# Altium schematic sheet Pyro_Channel.SchDoc
size B; SheetNumber: 5; SheetTotal: 7
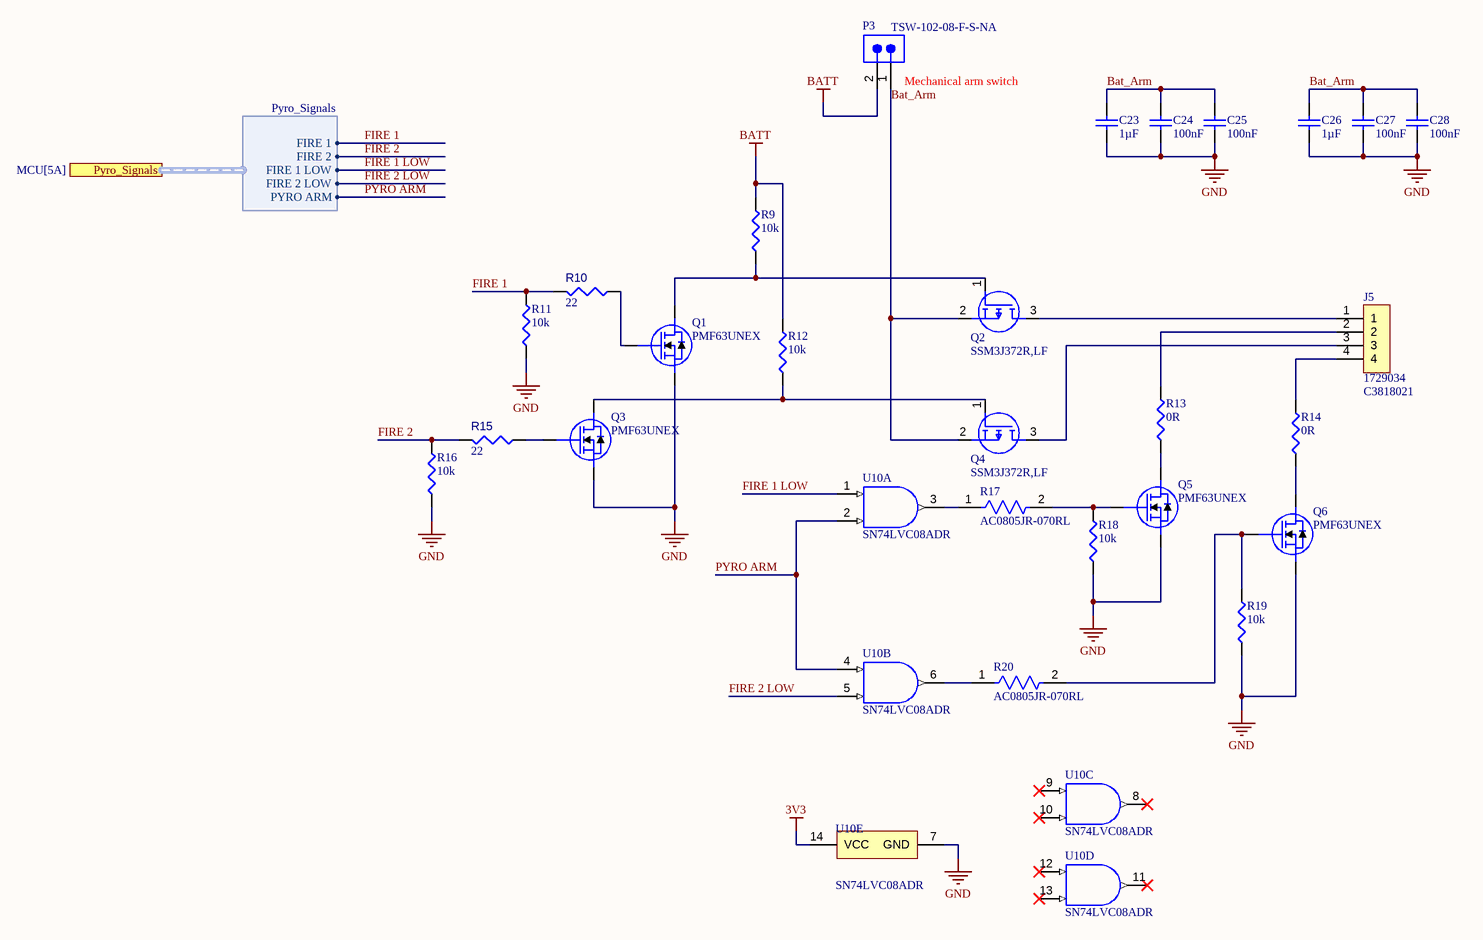
[diagram p0: Pyro_Channel.SchDoc]

## Parts
C23  value 1µF  [0402_C]  (hidden comment: CL05A105KL5NRNC)
C24  100nF  [0402_C]
C25  100nF  [0402_C]
C26  value 1µF  [0402_C]  (hidden comment: CL05A105KL5NRNC)
C27  100nF  [0402_C]
C28  100nF  [0402_C]
J5  1729034  LCSC Part Number: C3818021  [1729034]
P3  TSW-102-08-F-S-NA  [SMTC-TSW-102-08-X-S-NA]
Q1  PMF63UNEX  [PMF63UNEX-Footprint-1]
Q2  SSM3J372R,LF  [SSM3J372RLF]
Q3  PMF63UNEX  [PMF63UNEX-Footprint-1]
Q4  SSM3J372R,LF  [SSM3J372RLF]
Q5  PMF63UNEX  [PMF63UNEX-Footprint-1]
Q6  PMF63UNEX  [PMF63UNEX-Footprint-1]
R9  10k  [0402_R]
R10  value 22  [RESC0402(1005)_L]  (hidden comment: Resistor 22R  +/-5 % 0402 63 mW)
R11  10k  [0402_R]
R12  10k  [0402_R]
R13  0R  [0402_R]
R14  0R  [0402_R]
R15  value 22  [RESC0402(1005)_L]  (hidden comment: Resistor 22R  +/-5 % 0402 63 mW)
R16  10k  [0402_R]
R17  AC0805JR-070RL  [FP-AC0805-0_6-MFG]
R18  10k  [0402_R]
R19  10k  [0402_R]
R20  AC0805JR-070RL  [FP-AC0805-0_6-MFG]
U10  SN74LVC08ADR  [D0014A_N]  (parts A,B,C,D,E of 5)

## Ports
Pyro_Signals (harness Pyro_Signals, see MCU[5A])

## Harnesses
Pyro_Signals: FIRE 1, FIRE 2, FIRE 1 LOW, PYRO ARM, FIRE 2 LOW

## Nets
3V3: U10.14(VCC)
BATT: P3.2 R9.1 R12.1
GND: C23.1 C24.1 C25.1 C26.1 C27.1 C28.1 Q1.3(S) Q3.3(S) Q5.3(S) Q6.3(S) R11.1 R16.1 R18.1 R19.1 U10.7(GND)
Bat_Arm: C23.2 C24.2 C25.2 C26.2 C27.2 C28.2 P3.1 Q2.2(S) Q4.2(S)
FIRE 1: R10.2 R11.2 ; port Pyro_Signals.FIRE 1
FIRE 1 LOW: U10.1(1A) ; port Pyro_Signals.FIRE 1 LOW
FIRE 2: R15.2 R16.2 ; port Pyro_Signals.FIRE 2
FIRE 2 LOW: U10.5(2B) ; port Pyro_Signals.FIRE 2 LOW
PYRO ARM: U10.2(1B) U10.4(2A) ; port Pyro_Signals.PYRO ARM
NetJ5_1: J5.1 Q2.3(D)
NetJ5_2: J5.2 R13.2
NetJ5_3: J5.3 Q4.3(D)
NetJ5_4: J5.4 R14.2
NetQ1_1: Q1.1(G) R10.1
NetQ1_2: Q1.2(D) Q2.1(G) R9.2
NetQ3_1: Q3.1(G) R15.1
NetQ3_2: Q3.2(D) Q4.1(G) R12.2
NetQ5_1: Q5.1(G) R17.2 R18.2
NetQ5_2: Q5.2(D) R13.1
NetQ6_1: Q6.1(G) R19.2 R20.2
NetQ6_2: Q6.2(D) R14.1
NetR17_1: R17.1 U10.3(1Y)
NetR20_1: R20.1 U10.6(2Y)

Not connected (* = marked no-connect by the designer): U10 8(3Y)* 9(3A)* 10(3B)* 11(4Y)* 12(4A)* 13(4B)*

## Notes on the sheet
- (near P3) Mechanical arm switch
- DWG NO:
- REV:
- THIS DOCUMENT AND THE DATA DISCLOSED HEREIN OR
- HEREWITH IS THE PROPERTY OF ALTIUM LIMITED AND MAY
- BE FREELY DISTRIBUTED IN WHOLE. NO RIGHTS ARE
- RESERVED OR EXPRESS OR IMPLIED WARANTEE GIVEN.
- REVISION
- DESCRIPTION
- DATE
- APPROVED
- ENG:
- APPROVALS
- PROJECT
- DSN:
- CHK:
- REFERENCE DOCUMENTS
- PROJECT REVISION:
- TITLE
- DOCUMENT REVISION:
- DESIGN ITEM:
- BOM:
- FAB DWG:
- PCB DWG:
- ASSY DWG:
- SCALE:
- A2
- SIZE
- CAGE CODE
- FILE NAME
- DWG NO.
- SHEET
- OF
- REV

## Library data of the parts
C23 C26 = CMP-001-00091-2: Ceramic Capacitor, Multilayer, Ceramic, 35V, 10% +Tol, 10% -Tol, X5R, 15% TC, 1uF, Surface Mount, 0402; Manufacturer: Samsung; Tolerance: 1%; Working Voltage: 50V; Temperature Coefficient: 100ppm/°C; Rated Temperature: 70°C; Power: 62.5mW; Multilayer: Yes; Reference Standard: AEC-Q200; Package Height: 0.32mm; Additional Feature: LASER TRIMMABLE; Package Width: 0.5mm; Package Length: 1mm; RoHS Compliant: Yes; Rated DC Voltage (URdc): 35V; Termination: Wraparound; ComponentLink1URL: https://datasheet.ciiva.com:443/pdfs/VipMasterIC/IC/SEMS/SEMS-S-A0008384515/SEMS-S-A0008872905-1.pdf?src-supplier=IHS+Markit; Tolerance  (fill in as +-): 10%; Technology: METAL GLAZE/THICK FILM; Construction: Chip; Max Operating Temperature: 85°C; ComponentLink2URL: http://www.samsungsem.com/kr/support/product-search/mlcc/CL05A105KL5NRNC.jsp?src-supplier=Digikey; Pricing: 1=0.31, 10=0.181, 50=0.1296, 100=0.1136, 500=0.08658, 1000=0.07816, 2500=0.06921, 5000=0.06379, 10000=0.0593, 20000=0.05558, 30000=0.0537, 50000=0.05162, 70000=0.0504, 100000=0.04922 (USD); ComponentLink4Description: https://datasheet.ciiva.com:443/pdfs/VipMasterIC/IC/YAGO/YAGO-S-A0003597364/YAGO-S-A0003597364-1.pdf?src-supplier=IHS+Markit; Mounting Technology: Surface Mount; Stock: 299048; LCSC Part Number: C307413; Terminal Finish: Nickel; JESD-609 Code: e3; Dielectric Material: Ceramic; Tolerance (fill in as +-): 10%; ComponentLink4URL: https://datasheet.ciiva.com:443/pdfs/VipMasterIC/IC/YAGO/YAGO-S-A0003597364/YAGO-S-A0003597364-1.pdf?src-supplier=IHS+Markit; Pins: 2; ComponentLink5Description: https://datasheet.ciiva.com/12656/pyu-ac-51-rohs-l-2-12656634.pdf?src-supplier=Mouser; ComponentLink1Description: https://datasheet.ciiva.com:443/pdfs/VipMasterIC/IC/SEMS/SEMS-S-A0008384515/SEMS-S-A0008872905-1.pdf?src-supplier=IHS+Markit; ComponentLink3URL: https://datasheet.octopart.com/CL05A105KL5NRNC-Samsung-datasheet-8326407.pdf?src-supplier=TME; Min Operating Temperature: -55°C; ComponentLink2Description: http://www.samsungsem.com/kr/support/product-search/mlcc/CL05A105KL5NRNC.jsp?src-supplier=Digikey; Component Type: Standard; Package Style: SMTMeter; ComponentLink3Description: https://datasheet.octopart.com/CL05A105KL5NRNC-Samsung-datasheet-8326407.pdf?src-supplier=TME; Temperature Characteristics Code: X5R; Reach SVHC Compliant: Yes; Category: Ceramic Capacitors; Capacitor Type: Ceramic; RoHS: Yes; Case/Package: 0402; Package Shape: Rectangular; Design Item ID: CL05A105KL5NRNC; Manufacturer Part Number: CL05A105KL5NRNC; Packaging: Tape and Reel; Resistor Type: FIXED RESISTOR; ComponentLink5URL: https://datasheet.ciiva.com/12656/pyu-ac-51-rohs-l-2-12656634.pdf?src-supplier=Mouser; Source: Hybrids_Avionics.SCHLIB
C24 C25 C27 C28 = C_100nF_0402: Ceramic Capacitor, Multilayer, Ceramic, 16V, 10% +Tol, 10% -Tol, X7R, +-15% TC, 100nF, Surface Mount, 0402 inch; Manufacturer: Samsung Electro-Mechanics; Manufacturer Part Number: CL05B104KO5NNNC; Supplier: DigiKey; Supplier Part Number: 1276-1001-1-ND; RoHS: Compliant; Category: Ceramic Capacitors; Stock: 253470; Pricing: 1=0.08, 10=0.009, 50=0.0076, 100=0.0064, 500=0.0056, 1000=0.004, 2500=0.00394 (USD); Value: 100nF; Case/Package: 0402; Case Code (Imperial): 0402; Case Code (Metric): 1005; China RoHS: Compliant; Contact Plating: Tin; Depth: 500µm; Dielectric: X7R; Dielectric Material: Ceramic; Height: 500µm; Lead Free: Lead Free; Length: 1mm; Lifecycle Status: Production; Material: Ceramic; Max Operating Temperature: 125°C; Min Operating Temperature: -55°C; Mounting Technology: Surface Mount; Number of Terminals: 2; Radiation Hardening: No; REACH SVHC: Yes; Schedule B: 8532240020, 8532240020|8532240020|8532240020|8532240020|8532240020|8532240020|8532240020|8532240020|8532240020|8532240020|8532240020|8532240020|8532240020|8532240020|8532240020|8532240020|8532240020|8532240020|8532240020|8532240020|8532240020|8532240020|8532240020|85; Thickness: 558.8µm; Tolerance: 10%; Voltage: 16V; Voltage Rating: 16V; Voltage Rating (DC): 16V; Width: 500µm; ComponentLink1URL: https://datasheet.octopart.com:443/CL05B104KO5NNNC-Samsung-Electro-Mechanics-datasheet-181960518.pdf?src-supplier=IHS; ComponentLink1Description: https://datasheet.octopart.com:443/CL05B104KO5NNNC-Samsung-Electro-Mechanics-datasheet-181960518.pdf?src-supplier=IHS; ComponentLink2URL: https://datasheet.octopart.com:443/CL05B104KO5NNNC-Samsung-Electro-Mechanics-datasheet-81461623.pdf?src-supplier=Upverter; ComponentLink2Description: https://datasheet.octopart.com:443/CL05B104KO5NNNC-Samsung-Electro-Mechanics-datasheet-81461623.pdf?src-supplier=Upverter; ComponentLink3URL: https://datasheet.octopart.com/CL05B104KO5NNNC-Samsung-Electro-Mechanics-datasheet-8324245.pdf; ComponentLink3Description: https://datasheet.octopart.com/CL05B104KO5NNNC-Samsung-Electro-Mechanics-datasheet-8324245.pdf; ComponentLink4URL: https://datasheet.octopart.com/CL05B104KO5NNNC-Samsung-Electro-Mechanics-datasheet-97040617.pdf; ComponentLink4Description: https://datasheet.octopart.com/CL05B104KO5NNNC-Samsung-Electro-Mechanics-datasheet-97040617.pdf; ComponentLink5URL: https://datasheet.octopart.com/General-Multilayer-Ceramic-Capacitors-Samsung-datasheet-family-111.pdf; ComponentLink5Description: https://datasheet.octopart.com/General-Multilayer-Ceramic-Capacitors-Samsung-datasheet-family-111.pdf; ComponentLink6URL: https://datasheet.octopart.com:443/CL05B104KO5NNNC-Samsung-Electro-Mechanics-datasheet-141346863.pdf?src-supplier=Samsung+SCT; ComponentLink6Description: https://datasheet.octopart.com:443/CL05B104KO5NNNC-Samsung-Electro-Mechanics-datasheet-141346863.pdf?src-supplier=Samsung+SCT; ComponentLink7URL: https://datasheet.octopart.com:443/CL05B104KO5NNNC-Samsung-datasheet-151956582.pdf?src-supplier=SOS+electronic; ComponentLink7Description: https://datasheet.octopart.com:443/CL05B104KO5NNNC-Samsung-datasheet-151956582.pdf?src-supplier=SOS+electronic; ComponentLink8URL: https://datasheet.octopart.com:443/CL05B104KO5NNNC-Samsung-datasheet-42485123.pdf?src-supplier=Future+Electronics; ComponentLink8Description: https://datasheet.octopart.com:443/CL05B104KO5NNNC-Samsung-datasheet-42485123.pdf?src-supplier=Future+Electronics; ComponentLink9URL: https://datasheet.octopart.com:443/CL05B104KO5NNNC-Samsung-datasheet-34153835.pdf?src-supplier=Future+Electronics; ComponentLink9Description: https://datasheet.octopart.com:443/CL05B104KO5NNNC-Samsung-datasheet-34153835.pdf?src-supplier=Future+Electronics; ComponentLink10URL: https://datasheet.octopart.com:443/CL05B104KO5NNNC-Samsung-datasheet-26589024.pdf?src-supplier=Future+Electronics; ComponentLink10Description: https://datasheet.octopart.com:443/CL05B104KO5NNNC-Samsung-datasheet-26589024.pdf?src-supplier=Future+Electronics; ComponentLink11URL: https://datasheet.octopart.com:443/CL05B104KO5NNNC-Samsung-Electro-Mechanics-datasheet-149136714.pdf?src-supplier=Future+Electronics; ComponentLink11Description: https://datasheet.octopart.com:443/CL05B104KO5NNNC-Samsung-Electro-Mechanics-datasheet-149136714.pdf?src-supplier=Future+Electronics; ComponentLink12URL: https://datasheet.octopart.com:443/CL05B104KO5NNNC-Samsung-datasheet-59220082.pdf?src-supplier=TME; ComponentLink12Description: https://datasheet.octopart.com:443/CL05B104KO5NNNC-Samsung-datasheet-59220082.pdf?src-supplier=TME; ComponentLink13URL: http://sigma.octopart.com:80/rohs_certificate/General-Multilayer-Ceramic-Capacitors-Samsung-family-110.pdf?src-supplier=Compliance+Statements; ComponentLink13Description: http://sigma.octopart.com:80/rohs_certificate/General-Multilayer-Ceramic-Capacitors-Samsung-family-110.pdf?src-supplier=Compliance+Statements; ComponentLink14URL: http://sigma.octopart.com:80/rohs_statement/General-Multilayer-Ceramic-Capacitors-Samsung-family-132.pdf?src-supplier=Compliance+Statements; ComponentLink14Description: http://sigma.octopart.com:80/rohs_statement/General-Multilayer-Ceramic-Capacitors-Samsung-family-132.pdf?src-supplier=Compliance+Statements; ComponentLink15URL: http://sigma.octopart.com:80/reach_statement/General-Multilayer-Ceramic-Capacitors-Samsung-family-133.pdf?src-supplier=Compliance+Statements; ComponentLink15Description: http://sigma.octopart.com:80/reach_statement/General-Multilayer-Ceramic-Capacitors-Samsung-family-133.pdf?src-supplier=Compliance+Statements; LCSC Part #: C1525
J5 = CMP-028-000000-1: TERM BLK 4POS SIDE ENTRY 5MM PCB; Manufacturer: Phoenix Contact; Number of Ways: 4; Number of Decks: 1; Voltage Rating: 250V; Fastening Method: SCREW; Wire/Cable Gauge: 16AWG; Safety Approval: UL; Current Rating: 13.5A; Wire Cross Section: 1.5mm2; RoHS Compliant: Yes; Reach SVHC Compliant: No; ComponentLink1Description: https://datasheet.ciiva.com:443/pdfs/VipMasterIC/IC/PCON/PCON-S-A0009615323/PCON-S-A0009615323-1.pdf?src-supplier=IHS+Markit; Source: Hybrids_Avionics.SCHLIB; ComponentLink6Description: https://datasheet.ciiva.com/14608/70054377-14608714.pdf?src-supplier=Allied+Electronics; ComponentLink2Description: https://datasheet.ciiva.com/824/1729034-824323.pdf?src-supplier=Digikey; ComponentLink4URL: https://datasheet.ciiva.com/15225/getdatasheetpartid-305793-15225961.pdf?src-supplier=Verical; Design Item ID: 1729034; Stock: 23266; Mounting Technology: Board; ComponentLink4Description: https://datasheet.ciiva.com/15225/getdatasheetpartid-305793-15225961.pdf?src-supplier=Verical; Component Type: Standard; ComponentLink6URL: https://datasheet.ciiva.com/14608/70054377-14608714.pdf?src-supplier=Allied+Electronics; Pin Count: 4; ComponentLink5URL: https://datasheet.ciiva.com/14110/mkdsn-series-eng-bro-14110735.pdf?src-supplier=Distrelec; Category: Terminal Blocks; Pricing: 1=2.26, 10=2.162, 50=2.068, 100=2.0116, 250=1.88, 500=1.7296, 1000=1.59801, 2500=1.5275 (USD); Number of Rows: 1; ComponentLink5Description: https://datasheet.ciiva.com/14110/mkdsn-series-eng-bro-14110735.pdf?src-supplier=Distrelec; RoHS: Yes; ComponentLink3Description: https://datasheet.ciiva.com/16071/1729034-16071818.pdf?src-supplier=Onlinecomponents.com; ComponentLink2URL: https://datasheet.ciiva.com/824/1729034-824323.pdf?src-supplier=Digikey; ComponentLink3URL: https://datasheet.ciiva.com/16071/1729034-16071818.pdf?src-supplier=Onlinecomponents.com; Terminal and Terminal Block Type: BARRIER STRIP TERMINAL BLOCK; Manufacturer Part Number: 1729034; ComponentLink1URL: https://datasheet.ciiva.com:443/pdfs/VipMasterIC/IC/PCON/PCON-S-A0009615323/PCON-S-A0009615323-1.pdf?src-supplier=IHS+Markit
P3 = CMP-1024-00317-1: 0.025" SQ Post Header, Through-hole, Right Angle, -55 to 125 degC, 2.54 mm Pitch, 2-Pin, Male, RoHS; Manufacturer: Samtec; Pitch: 2.54 mm; ComponentLink3URL: http://www.samtec.com/documents/webfiles/cpdf/TSW-XXX-XX-XXX-X-XX-XXX-MKT.pdf; ComponentLink1URL: http://www.samtec.com; PartNumber: TSW-102-08-F-S-NA; ComponentLink1Description: Manufacturer URL; DatasheetVersion: F-214; Temperature Range: -55 to 125 degC; Orientation: Right Angle; PackageReference: TSW-102-08-X-S-NA; Mounting Technology: Through-hole; PackageVersion: DM, 8/1988; PackageDescription: .025[0.64] SQ. Post Terminal Strip Assembly; ComponentLink2URL: http://www.samtec.com/documents/webfiles/pdf/TSW_TH.PDF; RoHS: True; ComponentLink3Description: Package Specification; ComponentLink2Description: Datasheet
Q1 Q3 Q5 Q6 = CMP-011-00020-2: MOSFET N-CH 20V 2.2A SOT323; Max Operating Temperature: 150°C; Mounting Technology: Surface Mount; Min Operating Temperature: -55°C; Pins: 3; Case/Package: SOT-323
Q2 = CMP-028-000006-1: MOSFET (P-Channel); Manufacturer_Name: Toshiba; Arrow Price/Stock: null?utm_currency=USD&region=nac; Pin Count: 3; Mouser Part Number: 757-SSM3J372RLF; Datasheet Link: https://toshiba.semicon-storage.com/ap-en/semiconductor/product/mosfets/detail.SSM3J372R.html; Source: Hybrids_Avionics.SCHLIB; Manufacturer_Part_Number: SSM3J372R,LF; Component Type: Standard; Design Item ID: SSM3J372R,LF; Arrow Part Number: SSM3J372R,LF; Height: 0.88mm; Mouser Price/Stock: https://www.mouser.co.uk/ProductDetail/Toshiba/SSM3J372RLF?qs=u16ybLDytRbJaSMlwq9MLA%3D%3D
Q4 = CMP-028-000014-1: MOSFET (P-Channel); Manufacturer_Name: Toshiba; Source: Hybrids_Avionics.SCHLIB; Pin Count: 3; Manufacturer_Part_Number: SSM3J372R,LF; Mouser Price/Stock: https://www.mouser.co.uk/ProductDetail/Toshiba/SSM3J372RLF?qs=u16ybLDytRbJaSMlwq9MLA%3D%3D; Height: 0.88mm; Mouser Part Number: 757-SSM3J372RLF; Datasheet Link: https://toshiba.semicon-storage.com/ap-en/semiconductor/product/mosfets/detail.SSM3J372R.html; Arrow Price/Stock: null?utm_currency=USD&region=nac; Arrow Part Number: SSM3J372R,LF; Component Type: Standard; Design Item ID: SSM3J372R,LF
R9 R11 R12 R16 R18 R19 = R_10k_0402: RES SMD 10K OHM 0.1% 1/16W 0402; Manufacturer: Yageo Group; Manufacturer Part Number: RC0402FR-071KL; Power Dissipation: 62.5mW; Power Rating: 63mW; Value: 10kΩ; Temperature Coefficient: 100ppm/°C; Tolerance: 1%; Voltage Rating: 50V; LCSC Part #: C191915; Supplier: DigiKey; Supplier Part Number: 311-1.00KLRTR-ND; RoHS: Compliant; Category: Chip SMD Resistors; Stock: 4926888; Pricing: 10000=0.00204, 20000=0.002, 30000=0.00196, 50000=0.00182, 70000=0.00181 (USD); Case/Package: 0402; Case Code (Imperial): 0402; Case Code (Metric): 0402; China RoHS: Non-Compliant; Composition: Thick Film; Depth: 500µm; Height: 350µm; Lead Free: Lead Free; Length: 1mm; Lifecycle Status: Production; Max Operating Temperature: 155°C; Military Standard: Not; Min Operating Temperature: -55°C; Mounting Technology: Surface Mount; Pins: 2; Number of Terminals: 2; Packaging: Tape & Reel; REACH SVHC: Yes; Schedule B: 8533210045, 8533210045|8533210045|8533210045|8533210045|8533210045|8533210045|8533210045|8533210045|8533210045|8533210045|8533210045|8533210045|8533210045|8533210045|8533210045|8533210045|8533210045|8533210045|8533210045|8533210045|8533210045|8533210045|8533210045|85; Termination: SMD/SMT; Voltage Rating (AC): 50V; Voltage Rating (DC): 50V; Width: 500µm; Working Voltage: 50V; ComponentLink1URL: https://datasheet.octopart.com:443/RC0402FR-071KL-Yageo-datasheet-175887523.pdf?src-supplier=IHS; ComponentLink1Description: https://datasheet.octopart.com:443/RC0402FR-071KL-Yageo-datasheet-175887523.pdf?src-supplier=IHS; ComponentLink2URL: https://datasheet.octopart.com:443/RC0402FR-071KL-Yageo-datasheet-164759695.pdf?src-supplier=Upverter; ComponentLink2Description: https://datasheet.octopart.com:443/RC0402FR-071KL-Yageo-datasheet-164759695.pdf?src-supplier=Upverter; ComponentLink3URL: https://datasheet.octopart.com:443/RC0402FR-071KL-Yageo-datasheet-103092701.pdf?src-supplier=Upverter; ComponentLink3Description: https://datasheet.octopart.com:443/RC0402FR-071KL-Yageo-datasheet-103092701.pdf?src-supplier=Upverter; ComponentLink4URL: https://sigma.octopart.com:443/138820526/technical_drawing/Yageo-RC0402FR-071KL.pdf?src-supplier=Upverter; ComponentLink4Description: https://sigma.octopart.com:443/138820526/technical_drawing/Yageo-RC0402FR-071KL.pdf?src-supplier=Upverter; ComponentLink5URL: https://datasheet.octopart.com:443/RC0402FR-071KL-Yageo-datasheet-98239111.pdf?src-supplier=Upverter; ComponentLink5Description: https://datasheet.octopart.com:443/RC0402FR-071KL-Yageo-datasheet-98239111.pdf?src-supplier=Upverter; ComponentLink6URL: https://datasheet.octopart.com:443/RC0402FR-071KL-Yageo-datasheet-10408619.pdf?src-supplier=Newark; ComponentLink6Description: https://datasheet.octopart.com:443/RC0402FR-071KL-Yageo-datasheet-10408619.pdf?src-supplier=Newark; ComponentLink7URL: https://datasheet.octopart.com:443/RC0402FR-071KL-Yageo-datasheet-8324527.pdf?src-supplier=Newark; ComponentLink7Description: https://datasheet.octopart.com:443/RC0402FR-071KL-Yageo-datasheet-8324527.pdf?src-supplier=Newark; ComponentLink8URL: https://datasheet.octopart.com:443/RC0402FR-071KL-Yageo-datasheet-62067350.pdf?src-supplier=Farnell; ComponentLink8Description: https://datasheet.octopart.com:443/RC0402FR-071KL-Yageo-datasheet-62067350.pdf?src-supplier=Farnell; ComponentLink9URL: https://datasheet.octopart.com:443/RC0402FR-071KL-Yageo-datasheet-12531192.pdf?src-supplier=Future+Electronics; ComponentLink9Description: https://datasheet.octopart.com:443/RC0402FR-071KL-Yageo-datasheet-12531192.pdf?src-supplier=Future+Electronics; ComponentLink10URL: https://datasheet.octopart.com:443/RC0402FR-071KL-Yageo-datasheet-137700087.pdf?src-supplier=Future+Electronics; ComponentLink10Description: https://datasheet.octopart.com:443/RC0402FR-071KL-Yageo-datasheet-137700087.pdf?src-supplier=Future+Electronics; ComponentLink11URL: https://datasheet.octopart.com:443/RC0402FR-071KL-Yageo-datasheet-8324255.pdf?src-supplier=Future+Electronics; ComponentLink11Description: https://datasheet.octopart.com:443/RC0402FR-071KL-Yageo-datasheet-8324255.pdf?src-supplier=Future+Electronics; ComponentLink12URL: https://datasheet.octopart.com:443/RC0402FR-071KL-Yageo-datasheet-8329306.pdf?src-supplier=element14; ComponentLink12Description: https://datasheet.octopart.com:443/RC0402FR-071KL-Yageo-datasheet-8329306.pdf?src-supplier=element14; ComponentLink13URL: https://datasheet.octopart.com:443/RC0402FR-071KL-Yageo-datasheet-505231.pdf?src-supplier=element14; ComponentLink13Description: https://datasheet.octopart.com:443/RC0402FR-071KL-Yageo-datasheet-505231.pdf?src-supplier=element14; ComponentLink14URL: https://datasheet.octopart.com:443/RC0402FR-071KL-Yageo-datasheet-175423674.pdf?src-supplier=SOS+electronic; ComponentLink14Description: https://datasheet.octopart.com:443/RC0402FR-071KL-Yageo-datasheet-175423674.pdf?src-supplier=SOS+electronic; ComponentLink15URL: https://datasheet.octopart.com:443/RC0402FR-071KL-Yageo-datasheet-148775077.pdf?src-supplier=TME; ComponentLink15Description: https://datasheet.octopart.com:443/RC0402FR-071KL-Yageo-datasheet-148775077.pdf?src-supplier=TME; ComponentLink16URL: https://datasheet.octopart.com:443/RC0402FR-071KL-Yageo-datasheet-79472498.pdf?src-supplier=Megastar; ComponentLink16Description: https://datasheet.octopart.com:443/RC0402FR-071KL-Yageo-datasheet-79472498.pdf?src-supplier=Megastar; ComponentLink17URL: https://datasheet.octopart.com/RC0402FR-071KL-Yageo-datasheet-73766026.pdf; ComponentLink17Description: https://datasheet.octopart.com/RC0402FR-071KL-Yageo-datasheet-73766026.pdf; ComponentLink18URL: http://sigma.octopart.com:80/rohs_statement/Yageo-company-2.pdf?src-supplier=Compliance+Statements; ComponentLink18Description: http://sigma.octopart.com:80/rohs_statement/Yageo-company-2.pdf?src-supplier=Compliance+Statements; ComponentLink19URL: http://sigma.octopart.com:80/conflict_mineral_statement/Yageo-company-3.pdf?src-supplier=Compliance+Statements; ComponentLink19Description: http://sigma.octopart.com:80/conflict_mineral_statement/Yageo-company-3.pdf?src-supplier=Compliance+Statements; Contact Plating: Tin; Features: Automotive AEC-Q200; Max Power Dissipation: 63mW; Number of Terminations: 2; Radiation Hardening: No; ComponentLink20URL: https://sigma.octopart.com:443/138766958/technical_drawing/Panasonic-ERA-2AEB103X.pdf?src-supplier=Upverter; ComponentLink20Description: https://sigma.octopart.com:443/138766958/technical_drawing/Panasonic-ERA-2AEB103X.pdf?src-supplier=Upverter; ComponentLink21URL: https://datasheet.octopart.com:443/ERA-2AEB103X-Panasonic-datasheet-62287448.pdf?src-supplier=Future+Electronics; ComponentLink21Description: https://datasheet.octopart.com:443/ERA-2AEB103X-Panasonic-datasheet-62287448.pdf?src-supplier=Future+Electronics; ComponentLink22URL: https://datasheet.octopart.com:443/ERA-2AEB103X-Panasonic-datasheet-12510007.pdf?src-supplier=Future+Electronics; ComponentLink22Description: https://datasheet.octopart.com:443/ERA-2AEB103X-Panasonic-datasheet-12510007.pdf?src-supplier=Future+Electronics; ComponentLink23URL: https://datasheet.octopart.com:443/ERA-2AEB103X-Panasonic-datasheet-11763931.pdf?src-supplier=Future+Electronics; ComponentLink23Description: https://datasheet.octopart.com:443/ERA-2AEB103X-Panasonic-datasheet-11763931.pdf?src-supplier=Future+Electronics; ComponentLink24URL: https://datasheet.octopart.com:443/ERA-2AEB103X-Panasonic-datasheet-10840895.pdf?src-supplier=Future+Electronics; ComponentLink24Description: https://datasheet.octopart.com:443/ERA-2AEB103X-Panasonic-datasheet-10840895.pdf?src-supplier=Future+Electronics; ComponentLink25URL: https://datasheet.octopart.com:443/ERA-2AEB103X-Panasonic-datasheet-8367715.pdf?src-supplier=Future+Electronics; ComponentLink25Description: https://datasheet.octopart.com:443/ERA-2AEB103X-Panasonic-datasheet-8367715.pdf?src-supplier=Future+Electronics; ComponentLink26URL: https://datasheet.octopart.com:443/ERA-2AEB103X-Panasonic-datasheet-5392808.pdf?src-supplier=Future+Electronics; ComponentLink26Description: https://datasheet.octopart.com:443/ERA-2AEB103X-Panasonic-datasheet-5392808.pdf?src-supplier=Future+Electronics; ComponentLink27URL: https://datasheet.octopart.com:443/ERA-2AEB103X-Panasonic-datasheet-136531316.pdf?src-supplier=TME; ComponentLink27Description: https://datasheet.octopart.com:443/ERA-2AEB103X-Panasonic-datasheet-136531316.pdf?src-supplier=TME; ComponentLink28URL: https://datasheet.octopart.com:443/ERA2AEB103X-Panasonic-datasheet-188913046.pdf?src-supplier=TME; ComponentLink28Description: https://datasheet.octopart.com:443/ERA2AEB103X-Panasonic-datasheet-188913046.pdf?src-supplier=TME; ComponentLink29URL: https://datasheet.octopart.com:443/ERA-2AEB103X-Panasonic-datasheet-13266200.pdf?src-supplier=_legacy+Avnet; ComponentLink29Description: https://datasheet.octopart.com:443/ERA-2AEB103X-Panasonic-datasheet-13266200.pdf?src-supplier=_legacy+Avnet; ComponentLink30URL: https://datasheet.octopart.com:443/ERA2AEB103X-Panasonic-datasheet-5311861.pdf?src-supplier=Newark; ComponentLink30Description: https://datasheet.octopart.com:443/ERA2AEB103X-Panasonic-datasheet-5311861.pdf?src-supplier=Newark; ComponentLink31URL: https://datasheet.octopart.com:443/ERA-2AEB103X-Panasonic-datasheet-61114971.pdf?src-supplier=Newark; ComponentLink31Description: https://datasheet.octopart.com:443/ERA-2AEB103X-Panasonic-datasheet-61114971.pdf?src-supplier=Newark; ComponentLink32URL: https://datasheet.octopart.com:443/ERA-2AEB103X-Panasonic-datasheet-34200419.pdf?src-supplier=Newark; ComponentLink32Description: https://datasheet.octopart.com:443/ERA-2AEB103X-Panasonic-datasheet-34200419.pdf?src-supplier=Newark; ComponentLink33URL: https://datasheet.octopart.com:443/ERA-2AEB103X-Panasonic-datasheet-7542722.pdf?src-supplier=element14+APAC; ComponentLink33Description: https://datasheet.octopart.com:443/ERA-2AEB103X-Panasonic-datasheet-7542722.pdf?src-supplier=element14+APAC; ComponentLink34URL: https://datasheet.octopart.com:443/ERA-2AEB103X-Panasonic-datasheet-154766165.pdf?src-supplier=Master+Electronics; ComponentLink34Description: https://datasheet.octopart.com:443/ERA-2AEB103X-Panasonic-datasheet-154766165.pdf?src-supplier=Master+Electronics; ComponentLink35URL: https://datasheet.octopart.com:443/ERA-2AEB103X-Panasonic-datasheet-46744048.pdf?src-supplier=RS+(Formerly+Allied+Electronics); ComponentLink35Description: https://datasheet.octopart.com:443/ERA-2AEB103X-Panasonic-datasheet-46744048.pdf?src-supplier=RS+(Formerly+Allied+Electronics); ComponentLink36URL: https://sigma.octopart.com:443/150570796/technical_drawing/Panasonic-ERA2AEB103X.pdf?src-supplier=Panasonic+SCT; ComponentLink36Description: https://sigma.octopart.com:443/150570796/technical_drawing/Panasonic-ERA2AEB103X.pdf?src-supplier=Panasonic+SCT; ComponentLink37URL: https://datasheet.octopart.com/ERA-2AEB103X-Panasonic-datasheet-78375410.pdf; ComponentLink37Description: https://datasheet.octopart.com/ERA-2AEB103X-Panasonic-datasheet-78375410.pdf; ComponentLink38URL: https://datasheet.octopart.com:443/ERA2AEB103X-Panasonic---ECG-datasheet-15994758.pdf?src-supplier=Farnell; ComponentLink38Description: https://datasheet.octopart.com:443/ERA2AEB103X-Panasonic---ECG-datasheet-15994758.pdf?src-supplier=Farnell; ComponentLink39URL: https://datasheet.octopart.com:443/ERA2AEB103X-Panasonic-datasheet-10050158.pdf?src-supplier=Arrow+Electronics; ComponentLink39Description: https://datasheet.octopart.com:443/ERA2AEB103X-Panasonic-datasheet-10050158.pdf?src-supplier=Arrow+Electronics; ComponentLink40URL: https://datasheet.octopart.com:443/ERA-2AEB103X-Panasonic-datasheet-33006989.pdf?src-supplier=Electro+Sonic; ComponentLink40Description: https://datasheet.octopart.com:443/ERA-2AEB103X-Panasonic-datasheet-33006989.pdf?src-supplier=Electro+Sonic
R10 R15 = CMP-009-00164-4: Chip Resistor, 22 Ohms, +/-5 %, 63 mW, -55 to 155 degC, 0402; Tolerance: 5%; Power: 63mW; Pins: 2; Min Operating Temperature: -55°C; Max Operating Temperature: 155°C; Case/Package: 0402
R13 R14 = R_0R_0402: GENERAL PURPOSE CHIP RESISTOR Metal Glaze/thick Film, 0.0625W, 0ohm, Surface Mount, 0402; Manufacturer: Yageo Group; Manufacturer Part Number: RC0402JR-070RL; Max Power Dissipation: 63mW; Power Dissipation: 62.5mW; Value: 0Ω; Temperature Coefficient: 200ppm/°C; Tolerance: 5%; Voltage Rating: 50V; Supplier: DigiKey; Supplier Part Number: 311-0.0JRDKR-ND; RoHS: Compliant; Category: Chip SMD Resistors; Stock: 23041339; Pricing: 1=0.1, 10=0.010, 25=0.0064, 50=0.0054, 100=0.0047, 250=0.00392, 500=0.00346, 1000=0.00304, 5000=0.0023 (USD); Case/Package: 0402; Case Code (Imperial): 0402; China RoHS: Non-Compliant; Composition: Thick Film; Contact Plating: Tin; Depth: 500µm; Features: Moisture Resistant; Height: 350µm; Lead Free: Lead Free; Length: 1mm; Lifecycle Status: Production; Max Operating Temperature: 155°C; Military Standard: Not; Min Operating Temperature: -55°C; Mounting Technology: Surface Mount; Pins: 2; Number of Terminals: 2; Number of Terminations: 2; Packaging: Tape & Reel; Power Rating: 63mW; Radiation Hardening: No; REACH SVHC: Yes; Schedule B: 8533290000, 8533290000|8533290000, 8533290000|8533290000|8533290000, 8533290000|8533290000|8533290000|8533290000; Termination: SMD/SMT; Voltage Rating (DC): 50V; Width: 500µm; ComponentLink1URL: https://datasheet.octopart.com:443/RC0402JR-070RL-Yageo-datasheet-182189538.pdf?src-supplier=IHS; ComponentLink1Description: https://datasheet.octopart.com:443/RC0402JR-070RL-Yageo-datasheet-182189538.pdf?src-supplier=IHS; ComponentLink2URL: https://datasheet.octopart.com:443/RC0402JR-070RL-Yageo-datasheet-10408619.pdf?src-supplier=Newark; ComponentLink2Description: https://datasheet.octopart.com:443/RC0402JR-070RL-Yageo-datasheet-10408619.pdf?src-supplier=Newark; ComponentLink3URL: https://datasheet.octopart.com:443/RC0402JR-070RL-Yageo-datasheet-12531192.pdf?src-supplier=Seeed+Studio; ComponentLink3Description: https://datasheet.octopart.com:443/RC0402JR-070RL-Yageo-datasheet-12531192.pdf?src-supplier=Seeed+Studio; ComponentLink4URL: https://datasheet.octopart.com:443/RC0402JR-070RL-Yageo-datasheet-8324527.pdf?src-supplier=TME; ComponentLink4Description: https://datasheet.octopart.com:443/RC0402JR-070RL-Yageo-datasheet-8324527.pdf?src-supplier=TME; ComponentLink5URL: https://datasheet.octopart.com:443/RC0402JR-070RL-Yageo-datasheet-62067350.pdf?src-supplier=Farnell; ComponentLink5Description: https://datasheet.octopart.com:443/RC0402JR-070RL-Yageo-datasheet-62067350.pdf?src-supplier=Farnell; ComponentLink6URL: https://datasheet.octopart.com:443/RC0402JR-070RL-Yageo-datasheet-8329306.pdf?src-supplier=element14; ComponentLink6Description: https://datasheet.octopart.com:443/RC0402JR-070RL-Yageo-datasheet-8329306.pdf?src-supplier=element14; ComponentLink7URL: https://datasheet.octopart.com:443/RC0402JR-070RL-Yageo-datasheet-505231.pdf?src-supplier=element14; ComponentLink7Description: https://datasheet.octopart.com:443/RC0402JR-070RL-Yageo-datasheet-505231.pdf?src-supplier=element14; ComponentLink8URL: https://datasheet.octopart.com:443/RC0402JR-070RL-Yageo-datasheet-175423674.pdf?src-supplier=SOS+electronic; ComponentLink8Description: https://datasheet.octopart.com:443/RC0402JR-070RL-Yageo-datasheet-175423674.pdf?src-supplier=SOS+electronic; ComponentLink9URL: https://datasheet.octopart.com:443/RC0402JR-070RL-Yageo-datasheet-164759695.pdf?src-supplier=Future+Electronics; ComponentLink9Description: https://datasheet.octopart.com:443/RC0402JR-070RL-Yageo-datasheet-164759695.pdf?src-supplier=Future+Electronics; ComponentLink10URL: https://datasheet.octopart.com:443/RC0402JR-070RL-Yageo-datasheet-137700087.pdf?src-supplier=Future+Electronics; ComponentLink10Description: https://datasheet.octopart.com:443/RC0402JR-070RL-Yageo-datasheet-137700087.pdf?src-supplier=Future+Electronics; ComponentLink11URL: https://datasheet.octopart.com/RC0402JR-070RL-Yageo-datasheet-73766026.pdf; ComponentLink11Description: https://datasheet.octopart.com/RC0402JR-070RL-Yageo-datasheet-73766026.pdf; ComponentLink12URL: http://sigma.octopart.com:80/rohs_statement/Yageo-company-2.pdf?src-supplier=Compliance+Statements; ComponentLink12Description: http://sigma.octopart.com:80/rohs_statement/Yageo-company-2.pdf?src-supplier=Compliance+Statements; ComponentLink13URL: http://sigma.octopart.com:80/conflict_mineral_statement/Yageo-company-3.pdf?src-supplier=Compliance+Statements; ComponentLink13Description: http://sigma.octopart.com:80/conflict_mineral_statement/Yageo-company-3.pdf?src-supplier=Compliance+Statements; LCSC Part #: C60485
R17 R20 = CMP-03412-037823-1: RES SMD 0 OHM JUMPER 1/8W 0805; Voltage Rating: 150V; Temperature Coefficient: 200ppm/°C; Tolerance: 5%; Max Power Dissipation: 125mW; Resistance: 0R; Number of Terminations: 2; Width: 1.25mm; Case/Package: 0805; Min Operating Temperature: -55°C; Case Code (Imperial): 0805; Height: 0.024inch; Resistor Type: Thick Film; Features: Moisture Resistant; Power Rating: 125mW; Length: 0.079inch; Lead Free: Lead Free; Series: AC; Packaging: Tape and Reel; Termination: SMD/SMT; Max Operating Temperature: 155°C; Case Code (Metric): 2012
U10 = CMP-0777-00108-3: Quadruple 2-Input Positive-AND Gate, D0014A, LARGE T&R; Manufacturer: Texas Instruments; Input Type: TTL; Output Drive (IOL/IOH)(Max)(mA): -24/24; Rating: Catalog; Technology Family: LVC; tpd @ Nom Voltage(Max)(ns): 9.8,6.9,4.8,4.1; ICC @ Nom Voltage(Max)(mA): 0.01; Voltage(Nom)(V): 1.8,2.5,2.7,3.3; F @ Nom Voltage(Max)(Mhz): 70; Schmitt Trigger: No; Bits(#): 4; VCC(Max)(V): 3.6; VCC(Min)(V): 1.65; Generic Part Number: SN74LVC08A; Output Type: TTL; DatasheetVersion: SCAS283Q; Operating Temperature Range(C): -40 to 125; PackageReference: D0014A